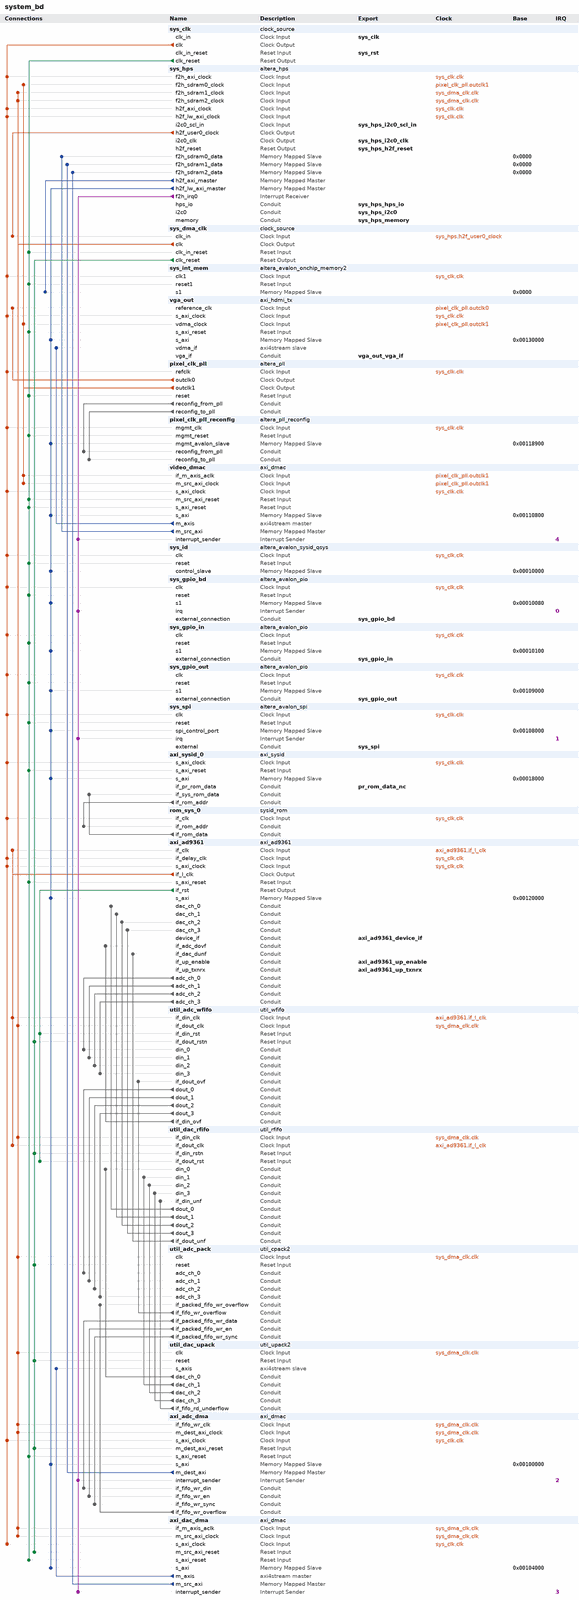
[diagram p0: system contents, whole]
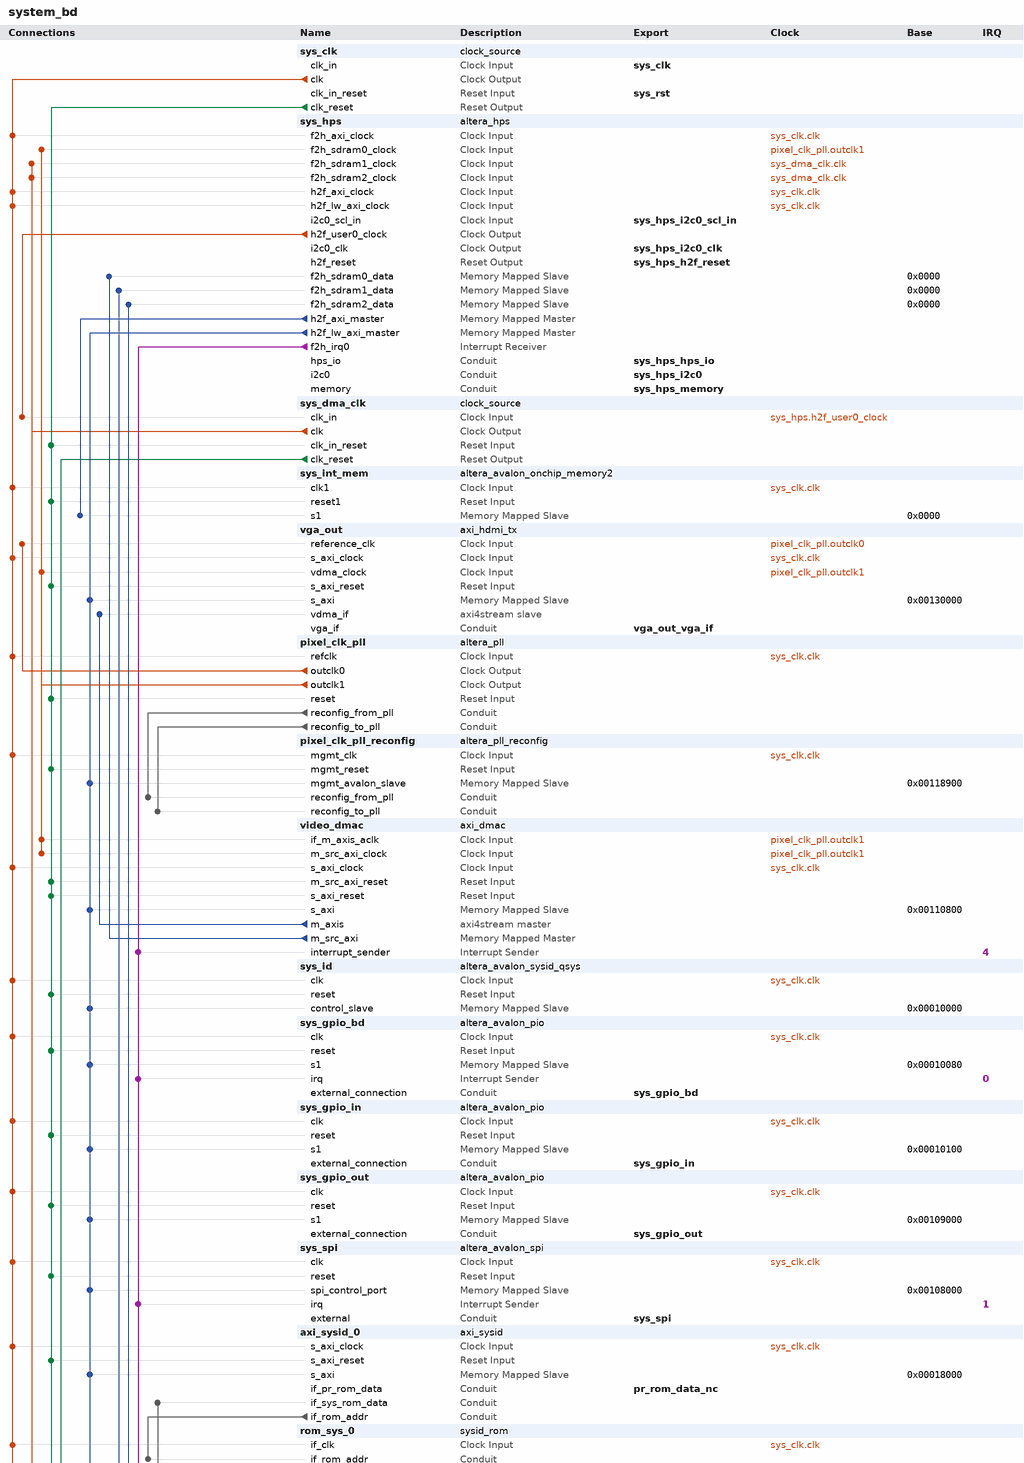
[diagram p1: system contents, upper part]
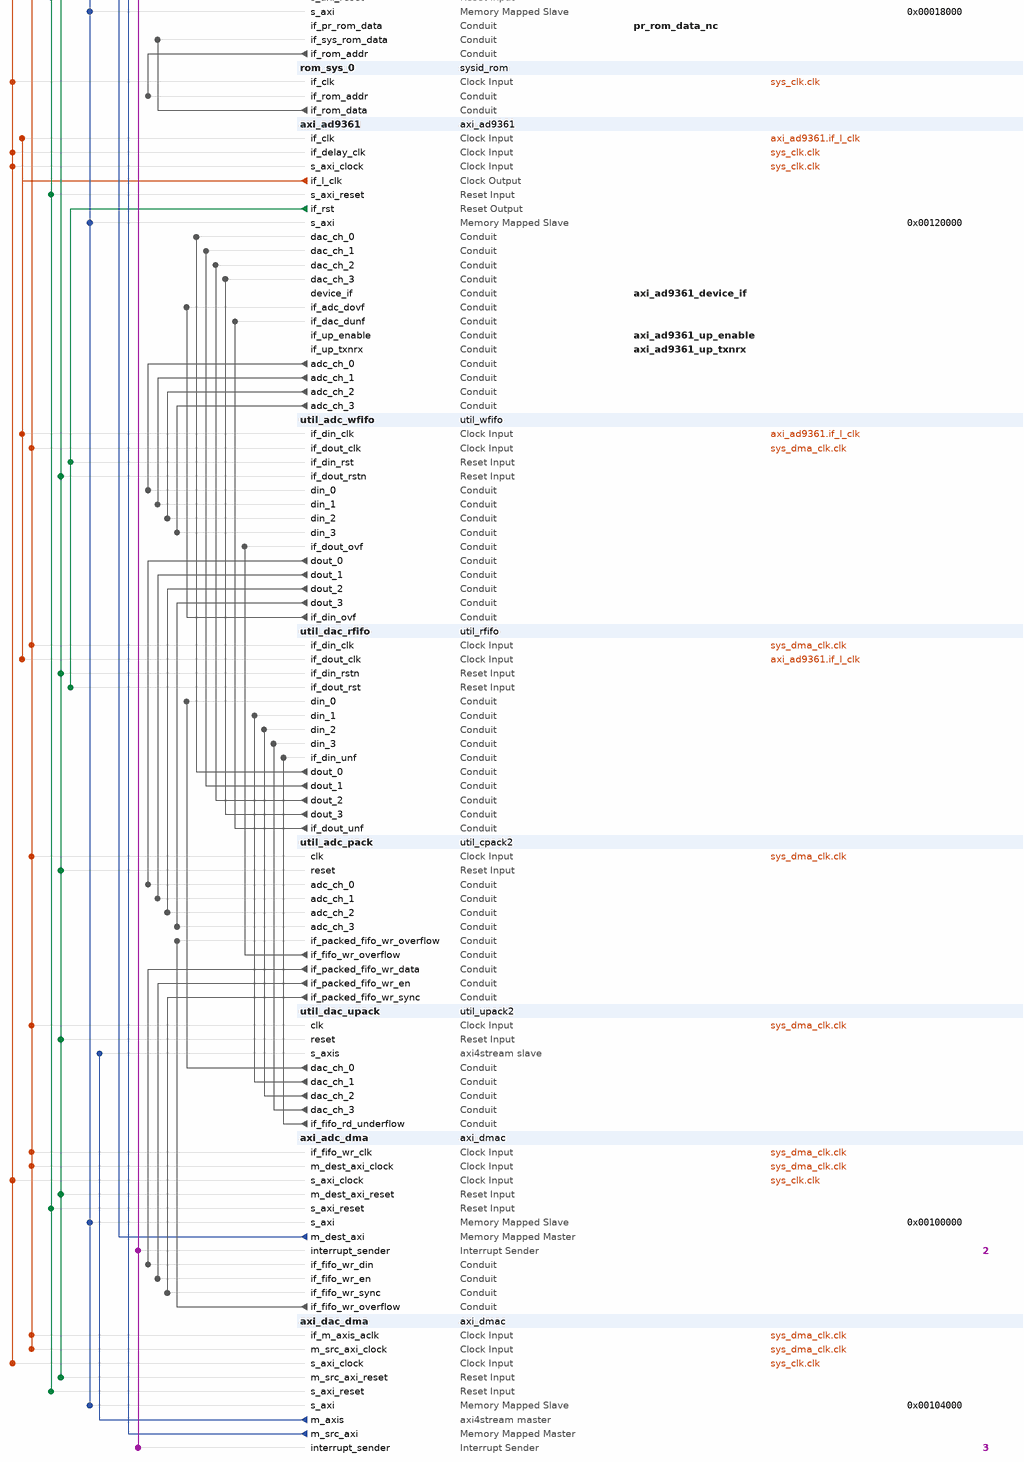
[diagram p2: system contents, lower part]
# Platform Designer (Qsys) system system_bd, Cyclone V 5CSXFC6D6F31C8ES
# Parameters at their usual value, and those the tool derives, are not listed.
package require -exact qsys 21.1
create_system system_bd
set_project_property DEVICE_FAMILY {Cyclone V}
set_project_property DEVICE 5CSXFC6D6F31C8ES

add_instance sys_clk clock_source 21.1
set_instance_parameter_value sys_clk clockFrequency 50000000

add_instance sys_hps altera_hps 21.1
set_instance_parameter_value sys_hps EMAC1_Mode RGMII
set_instance_parameter_value sys_hps EMAC1_PinMuxing {HPS I/O Set 0}
set_instance_parameter_value sys_hps F2SCLK_COLDRST_Enable false
set_instance_parameter_value sys_hps F2SCLK_DBGRST_Enable false
set_instance_parameter_value sys_hps F2SCLK_WARMRST_Enable false
set_instance_parameter_value sys_hps F2SDRAM_Type AXI-3,AXI-3,AXI-3
set_instance_parameter_value sys_hps F2SDRAM_Width 64,128,64
set_instance_parameter_value sys_hps F2SINTERRUPT_Enable true
set_instance_parameter_value sys_hps F2S_Width 2
set_instance_parameter_value sys_hps FPGA_PERIPHERAL_OUTPUT_CLOCK_FREQ_EMAC0_GTX_CLK 125
set_instance_parameter_value sys_hps FPGA_PERIPHERAL_OUTPUT_CLOCK_FREQ_EMAC0_MD_CLK 2.5
set_instance_parameter_value sys_hps FPGA_PERIPHERAL_OUTPUT_CLOCK_FREQ_EMAC1_GTX_CLK 125
set_instance_parameter_value sys_hps FPGA_PERIPHERAL_OUTPUT_CLOCK_FREQ_EMAC1_MD_CLK 2.5
set_instance_parameter_value sys_hps HPS_PROTOCOL DDR3
set_instance_parameter_value sys_hps I2C0_Mode Full
set_instance_parameter_value sys_hps I2C0_PinMuxing FPGA
set_instance_parameter_value sys_hps I2C1_Mode N/A
set_instance_parameter_value sys_hps I2C1_PinMuxing Unused
set_instance_parameter_value sys_hps LWH2F_Enable true
set_instance_parameter_value sys_hps MEM_BANKADDR_WIDTH 3
set_instance_parameter_value sys_hps MEM_CLK_FREQ 400.0
set_instance_parameter_value sys_hps MEM_COL_ADDR_WIDTH 10
set_instance_parameter_value sys_hps MEM_DQ_WIDTH 32
set_instance_parameter_value sys_hps MEM_DRV_STR RZQ/7
set_instance_parameter_value sys_hps MEM_ROW_ADDR_WIDTH 15
set_instance_parameter_value sys_hps MEM_RTT_NOM RZQ/4
set_instance_parameter_value sys_hps MEM_RTT_WR RZQ/4
set_instance_parameter_value sys_hps MEM_TCL 11
set_instance_parameter_value sys_hps MEM_TFAW_NS 30.0
set_instance_parameter_value sys_hps MEM_TRAS_NS 35.0
set_instance_parameter_value sys_hps MEM_TRCD_NS 13.75
set_instance_parameter_value sys_hps MEM_TRFC_NS 260.0
set_instance_parameter_value sys_hps MEM_TRP_NS 13.75
set_instance_parameter_value sys_hps MEM_VENDOR JEDEC
set_instance_parameter_value sys_hps MEM_WTCL 8
set_instance_parameter_value sys_hps QSPI_Mode {1 SS}
set_instance_parameter_value sys_hps QSPI_PinMuxing {HPS I/O Set 0}
set_instance_parameter_value sys_hps REF_CLK_FREQ 25.0
set_instance_parameter_value sys_hps S2FCLK_USER0CLK_Enable true
set_instance_parameter_value sys_hps S2FCLK_USER2CLK 5
set_instance_parameter_value sys_hps S2F_Width 2
set_instance_parameter_value sys_hps SDIO_Mode {4-bit Data}
set_instance_parameter_value sys_hps SDIO_PinMuxing {HPS I/O Set 0}
set_instance_parameter_value sys_hps SPIM1_Mode {Single Slave Select}
set_instance_parameter_value sys_hps SPIM1_PinMuxing {HPS I/O Set 0}
set_instance_parameter_value sys_hps STM_Enable false
set_instance_parameter_value sys_hps TIMING_BOARD_AC_SKEW 0.03
set_instance_parameter_value sys_hps TIMING_BOARD_AC_TO_CK_SKEW 0.0
set_instance_parameter_value sys_hps TIMING_BOARD_DQ_TO_DQS_SKEW 0.0
set_instance_parameter_value sys_hps TIMING_BOARD_MAX_CK_DELAY 0.03
set_instance_parameter_value sys_hps TIMING_BOARD_MAX_DQS_DELAY 0.02
set_instance_parameter_value sys_hps TIMING_BOARD_SKEW_BETWEEN_DQS 0.08
set_instance_parameter_value sys_hps TIMING_BOARD_SKEW_CKDQS_DIMM_MAX 0.16
set_instance_parameter_value sys_hps TIMING_BOARD_SKEW_CKDQS_DIMM_MIN 0.09
set_instance_parameter_value sys_hps TIMING_BOARD_SKEW_WITHIN_DQS 0.01
set_instance_parameter_value sys_hps TIMING_TDH 65
set_instance_parameter_value sys_hps TIMING_TDQSCK 255
set_instance_parameter_value sys_hps TIMING_TDQSQ 125
set_instance_parameter_value sys_hps TIMING_TDS 30
set_instance_parameter_value sys_hps TIMING_TIH 140
set_instance_parameter_value sys_hps TIMING_TIS 180
set_instance_parameter_value sys_hps TIMING_TQSH 0.4
set_instance_parameter_value sys_hps UART0_Mode {No Flow Control}
set_instance_parameter_value sys_hps UART0_PinMuxing {HPS I/O Set 0}
set_instance_parameter_value sys_hps USB1_Mode SDR
set_instance_parameter_value sys_hps USB1_PinMuxing {HPS I/O Set 0}
set_instance_parameter_value sys_hps desired_cfg_clk_mhz 80.0
set_instance_parameter_value sys_hps desired_qspi_clk_mhz 400.0

add_instance sys_dma_clk clock_source 21.1
set_instance_parameter_value sys_dma_clk clockFrequency 50000000

add_instance sys_int_mem altera_avalon_onchip_memory2 21.1
set_instance_parameter_value sys_int_mem dataWidth 64
set_instance_parameter_value sys_int_mem dualPort false
set_instance_parameter_value sys_int_mem initMemContent false
set_instance_parameter_value sys_int_mem initializationFileName onchip_mem.hex
set_instance_parameter_value sys_int_mem memorySize 65536

add_instance vga_out axi_hdmi_tx 1.0
set_instance_parameter_value vga_out CR_CB_N 0
set_instance_parameter_value vga_out DEVICE 5CSXFC6D6F31C8ES
set_instance_parameter_value vga_out FPGA_TECHNOLOGY_MANUAL 100
set_instance_parameter_value vga_out ID 0
set_instance_parameter_value vga_out INTERFACE VGA_INTERFACE

add_instance pixel_clk_pll altera_pll 21.1
set_instance_parameter_value pixel_clk_pll gui_device_speed_grade 2
set_instance_parameter_value pixel_clk_pll gui_en_reconf true
set_instance_parameter_value pixel_clk_pll gui_number_of_clocks 2
set_instance_parameter_value pixel_clk_pll gui_operation_mode direct
set_instance_parameter_value pixel_clk_pll gui_output_clock_frequency0 65.0
set_instance_parameter_value pixel_clk_pll gui_output_clock_frequency1 100.0
set_instance_parameter_value pixel_clk_pll gui_pll_mode {Integer-N PLL}
set_instance_parameter_value pixel_clk_pll gui_reference_clock_frequency 50.0
set_instance_parameter_value pixel_clk_pll gui_use_locked false

add_instance pixel_clk_pll_reconfig altera_pll_reconfig 21.1

add_instance video_dmac axi_dmac 1.0
set_instance_parameter_value video_dmac ASYNC_CLK_DEST_REQ_MANUAL 1
set_instance_parameter_value video_dmac ASYNC_CLK_REQ_SRC_MANUAL 1
set_instance_parameter_value video_dmac ASYNC_CLK_SRC_DEST_MANUAL 1
set_instance_parameter_value video_dmac AXI_SLICE_DEST 0
set_instance_parameter_value video_dmac AXI_SLICE_SRC 0
set_instance_parameter_value video_dmac CLK_DOMAIN_DEST_AXI 0
set_instance_parameter_value video_dmac CLK_DOMAIN_DEST_FIFO 0
set_instance_parameter_value video_dmac CLK_DOMAIN_DEST_SAXI 4
set_instance_parameter_value video_dmac CLK_DOMAIN_REQ 5
set_instance_parameter_value video_dmac CLK_DOMAIN_SRC_AXI 4
set_instance_parameter_value video_dmac CLK_DOMAIN_SRC_FIFO 0
set_instance_parameter_value video_dmac CLK_DOMAIN_SRC_SAXI 0
set_instance_parameter_value video_dmac CYCLIC 1
set_instance_parameter_value video_dmac DISABLE_DEBUG_REGISTERS 0
set_instance_parameter_value video_dmac DMA_2D_TRANSFER 1
set_instance_parameter_value video_dmac DMA_AXIS_DEST_W 4
set_instance_parameter_value video_dmac DMA_AXIS_ID_W 8
set_instance_parameter_value video_dmac DMA_AXI_PROTOCOL_DEST 1
set_instance_parameter_value video_dmac DMA_AXI_PROTOCOL_SRC 1
set_instance_parameter_value video_dmac DMA_DATA_WIDTH_DEST 64
set_instance_parameter_value video_dmac DMA_DATA_WIDTH_SRC 64
set_instance_parameter_value video_dmac DMA_LENGTH_WIDTH 24
set_instance_parameter_value video_dmac DMA_TYPE_DEST 1
set_instance_parameter_value video_dmac DMA_TYPE_SRC 0
set_instance_parameter_value video_dmac ENABLE_DIAGNOSTICS_IF 0
set_instance_parameter_value video_dmac FIFO_SIZE 8
set_instance_parameter_value video_dmac HAS_AXIS_TDEST 0
set_instance_parameter_value video_dmac HAS_AXIS_TID 0
set_instance_parameter_value video_dmac HAS_AXIS_TKEEP 0
set_instance_parameter_value video_dmac HAS_AXIS_TLAST 1
set_instance_parameter_value video_dmac HAS_AXIS_TSTRB 0
set_instance_parameter_value video_dmac HAS_AXIS_TUSER 0
set_instance_parameter_value video_dmac ID 0
set_instance_parameter_value video_dmac MAX_BYTES_PER_BURST 128
set_instance_parameter_value video_dmac SYNC_TRANSFER_START 0

add_instance sys_id altera_avalon_sysid_qsys 21.1
set_instance_parameter_value sys_id id -1395322110

add_instance sys_gpio_bd altera_avalon_pio 21.1
set_instance_parameter_value sys_gpio_bd direction InOut
set_instance_parameter_value sys_gpio_bd generateIRQ true
set_instance_parameter_value sys_gpio_bd width 32

add_instance sys_gpio_in altera_avalon_pio 21.1
set_instance_parameter_value sys_gpio_in direction Input
set_instance_parameter_value sys_gpio_in generateIRQ true
set_instance_parameter_value sys_gpio_in width 32

add_instance sys_gpio_out altera_avalon_pio 21.1
set_instance_parameter_value sys_gpio_out direction Output
set_instance_parameter_value sys_gpio_out width 32

add_instance sys_spi altera_avalon_spi 21.1
set_instance_parameter_value sys_spi clockPolarity 1
set_instance_parameter_value sys_spi dataWidth 8
set_instance_parameter_value sys_spi masterSPI true
set_instance_parameter_value sys_spi numberOfSlaves 1
set_instance_parameter_value sys_spi targetClockRate 50000000

add_instance axi_sysid_0 axi_sysid 1.0
set_instance_parameter_value axi_sysid_0 ROM_ADDR_BITS 9
set_instance_parameter_value axi_sysid_0 ROM_WIDTH 32

add_instance rom_sys_0 sysid_rom 1.0
set_instance_parameter_value rom_sys_0 PATH_TO_FILE /home/guest/hdl_repo/jemfg/jemfgeronimo_hdl/hdl/projects/arradio/c5soc/mem_init_sys.txt
set_instance_parameter_value rom_sys_0 ROM_ADDR_BITS 9
set_instance_parameter_value rom_sys_0 ROM_WIDTH 32

add_instance axi_ad9361 axi_ad9361 1.0
set_instance_parameter_value axi_ad9361 ADC_DATAFORMAT_DISABLE 0
set_instance_parameter_value axi_ad9361 ADC_DATAPATH_DISABLE 0
set_instance_parameter_value axi_ad9361 ADC_DCFILTER_DISABLE 0
set_instance_parameter_value axi_ad9361 ADC_IQCORRECTION_DISABLE 0
set_instance_parameter_value axi_ad9361 ADC_USERPORTS_DISABLE 0
set_instance_parameter_value axi_ad9361 CMOS_OR_LVDS_N 0
set_instance_parameter_value axi_ad9361 DAC_DATAPATH_DISABLE 0
set_instance_parameter_value axi_ad9361 DAC_DDS_DISABLE 0
set_instance_parameter_value axi_ad9361 DAC_IODELAY_ENABLE 0
set_instance_parameter_value axi_ad9361 DAC_IQCORRECTION_DISABLE 0
set_instance_parameter_value axi_ad9361 DAC_USERPORTS_DISABLE 0
set_instance_parameter_value axi_ad9361 DEVICE 5CSXFC6D6F31C8ES
set_instance_parameter_value axi_ad9361 DEV_PACKAGE_MANUAL 0
set_instance_parameter_value axi_ad9361 FPGA_FAMILY_MANUAL 0
set_instance_parameter_value axi_ad9361 FPGA_TECHNOLOGY_MANUAL 100
set_instance_parameter_value axi_ad9361 ID 0
set_instance_parameter_value axi_ad9361 IO_DELAY_GROUP dev_if_delay_group
set_instance_parameter_value axi_ad9361 MIMO_ENABLE 0
set_instance_parameter_value axi_ad9361 MODE_1R1T 0
set_instance_parameter_value axi_ad9361 RX_NODPA 0
set_instance_parameter_value axi_ad9361 SPEED_GRADE_MANUAL 0
set_instance_parameter_value axi_ad9361 TDD_DISABLE 0

add_instance util_adc_wfifo util_wfifo 1.0
set_instance_parameter_value util_adc_wfifo DIN_ADDRESS_WIDTH 5
set_instance_parameter_value util_adc_wfifo DIN_DATA_WIDTH 16
set_instance_parameter_value util_adc_wfifo DOUT_DATA_WIDTH 16
set_instance_parameter_value util_adc_wfifo NUM_OF_CHANNELS 4

add_instance util_dac_rfifo util_rfifo 1.0
set_instance_parameter_value util_dac_rfifo DIN_ADDRESS_WIDTH 5
set_instance_parameter_value util_dac_rfifo DIN_DATA_WIDTH 16
set_instance_parameter_value util_dac_rfifo DOUT_DATA_WIDTH 16
set_instance_parameter_value util_dac_rfifo NUM_OF_CHANNELS 4

add_instance util_adc_pack util_cpack2 1.0
set_instance_parameter_value util_adc_pack NUM_OF_CHANNELS 4
set_instance_parameter_value util_adc_pack SAMPLES_PER_CHANNEL 1
set_instance_parameter_value util_adc_pack SAMPLE_DATA_WIDTH 16

add_instance util_dac_upack util_upack2 1.0
set_instance_parameter_value util_dac_upack INTERFACE_TYPE 0
set_instance_parameter_value util_dac_upack NUM_OF_CHANNELS 4
set_instance_parameter_value util_dac_upack SAMPLES_PER_CHANNEL 1
set_instance_parameter_value util_dac_upack SAMPLE_DATA_WIDTH 16

add_instance axi_adc_dma axi_dmac 1.0
set_instance_parameter_value axi_adc_dma ASYNC_CLK_DEST_REQ_MANUAL 1
set_instance_parameter_value axi_adc_dma ASYNC_CLK_REQ_SRC_MANUAL 1
set_instance_parameter_value axi_adc_dma ASYNC_CLK_SRC_DEST_MANUAL 1
set_instance_parameter_value axi_adc_dma AXI_SLICE_DEST 0
set_instance_parameter_value axi_adc_dma AXI_SLICE_SRC 0
set_instance_parameter_value axi_adc_dma CLK_DOMAIN_DEST_AXI 7
set_instance_parameter_value axi_adc_dma CLK_DOMAIN_DEST_FIFO 0
set_instance_parameter_value axi_adc_dma CLK_DOMAIN_DEST_SAXI 0
set_instance_parameter_value axi_adc_dma CLK_DOMAIN_REQ 5
set_instance_parameter_value axi_adc_dma CLK_DOMAIN_SRC_AXI 0
set_instance_parameter_value axi_adc_dma CLK_DOMAIN_SRC_FIFO 7
set_instance_parameter_value axi_adc_dma CLK_DOMAIN_SRC_SAXI 0
set_instance_parameter_value axi_adc_dma CYCLIC 0
set_instance_parameter_value axi_adc_dma DISABLE_DEBUG_REGISTERS 0
set_instance_parameter_value axi_adc_dma DMA_2D_TRANSFER 0
set_instance_parameter_value axi_adc_dma DMA_AXIS_DEST_W 4
set_instance_parameter_value axi_adc_dma DMA_AXIS_ID_W 8
set_instance_parameter_value axi_adc_dma DMA_AXI_PROTOCOL_DEST 1
set_instance_parameter_value axi_adc_dma DMA_AXI_PROTOCOL_SRC 1
set_instance_parameter_value axi_adc_dma DMA_DATA_WIDTH_DEST 128
set_instance_parameter_value axi_adc_dma DMA_DATA_WIDTH_SRC 64
set_instance_parameter_value axi_adc_dma DMA_LENGTH_WIDTH 24
set_instance_parameter_value axi_adc_dma DMA_TYPE_DEST 0
set_instance_parameter_value axi_adc_dma DMA_TYPE_SRC 2
set_instance_parameter_value axi_adc_dma ENABLE_DIAGNOSTICS_IF 0
set_instance_parameter_value axi_adc_dma FIFO_SIZE 4
set_instance_parameter_value axi_adc_dma HAS_AXIS_TDEST 0
set_instance_parameter_value axi_adc_dma HAS_AXIS_TID 0
set_instance_parameter_value axi_adc_dma HAS_AXIS_TKEEP 0
set_instance_parameter_value axi_adc_dma HAS_AXIS_TLAST 0
set_instance_parameter_value axi_adc_dma HAS_AXIS_TSTRB 0
set_instance_parameter_value axi_adc_dma HAS_AXIS_TUSER 0
set_instance_parameter_value axi_adc_dma ID 0
set_instance_parameter_value axi_adc_dma MAX_BYTES_PER_BURST 128
set_instance_parameter_value axi_adc_dma SYNC_TRANSFER_START 1

add_instance axi_dac_dma axi_dmac 1.0
set_instance_parameter_value axi_dac_dma ASYNC_CLK_DEST_REQ_MANUAL 1
set_instance_parameter_value axi_dac_dma ASYNC_CLK_REQ_SRC_MANUAL 1
set_instance_parameter_value axi_dac_dma ASYNC_CLK_SRC_DEST_MANUAL 1
set_instance_parameter_value axi_dac_dma AXI_SLICE_DEST 0
set_instance_parameter_value axi_dac_dma AXI_SLICE_SRC 0
set_instance_parameter_value axi_dac_dma CLK_DOMAIN_DEST_AXI 0
set_instance_parameter_value axi_dac_dma CLK_DOMAIN_DEST_FIFO 0
set_instance_parameter_value axi_dac_dma CLK_DOMAIN_DEST_SAXI 7
set_instance_parameter_value axi_dac_dma CLK_DOMAIN_REQ 5
set_instance_parameter_value axi_dac_dma CLK_DOMAIN_SRC_AXI 7
set_instance_parameter_value axi_dac_dma CLK_DOMAIN_SRC_FIFO 0
set_instance_parameter_value axi_dac_dma CLK_DOMAIN_SRC_SAXI 0
set_instance_parameter_value axi_dac_dma CYCLIC 1
set_instance_parameter_value axi_dac_dma DISABLE_DEBUG_REGISTERS 0
set_instance_parameter_value axi_dac_dma DMA_2D_TRANSFER 0
set_instance_parameter_value axi_dac_dma DMA_AXIS_DEST_W 4
set_instance_parameter_value axi_dac_dma DMA_AXIS_ID_W 8
set_instance_parameter_value axi_dac_dma DMA_AXI_PROTOCOL_DEST 1
set_instance_parameter_value axi_dac_dma DMA_AXI_PROTOCOL_SRC 1
set_instance_parameter_value axi_dac_dma DMA_DATA_WIDTH_DEST 64
set_instance_parameter_value axi_dac_dma DMA_DATA_WIDTH_SRC 64
set_instance_parameter_value axi_dac_dma DMA_LENGTH_WIDTH 24
set_instance_parameter_value axi_dac_dma DMA_TYPE_DEST 1
set_instance_parameter_value axi_dac_dma DMA_TYPE_SRC 0
set_instance_parameter_value axi_dac_dma ENABLE_DIAGNOSTICS_IF 0
set_instance_parameter_value axi_dac_dma FIFO_SIZE 4
set_instance_parameter_value axi_dac_dma HAS_AXIS_TDEST 0
set_instance_parameter_value axi_dac_dma HAS_AXIS_TID 0
set_instance_parameter_value axi_dac_dma HAS_AXIS_TKEEP 0
set_instance_parameter_value axi_dac_dma HAS_AXIS_TLAST 0
set_instance_parameter_value axi_dac_dma HAS_AXIS_TSTRB 0
set_instance_parameter_value axi_dac_dma HAS_AXIS_TUSER 0
set_instance_parameter_value axi_dac_dma ID 0
set_instance_parameter_value axi_dac_dma MAX_BYTES_PER_BURST 128
set_instance_parameter_value axi_dac_dma SYNC_TRANSFER_START 0

# connections
add_connection axi_ad9361.if_l_clk axi_ad9361.if_clk clock
add_connection axi_ad9361.if_l_clk util_adc_wfifo.if_din_clk clock
add_connection axi_ad9361.if_l_clk util_dac_rfifo.if_dout_clk clock
add_connection pixel_clk_pll.outclk0 vga_out.reference_clk clock
add_connection pixel_clk_pll.outclk1 sys_hps.f2h_sdram0_clock clock
add_connection pixel_clk_pll.outclk1 vga_out.vdma_clock clock
add_connection pixel_clk_pll.outclk1 video_dmac.if_m_axis_aclk clock
add_connection pixel_clk_pll.outclk1 video_dmac.m_src_axi_clock clock
add_connection sys_clk.clk axi_ad9361.if_delay_clk clock
add_connection sys_clk.clk axi_ad9361.s_axi_clock clock
add_connection sys_clk.clk axi_adc_dma.s_axi_clock clock
add_connection sys_clk.clk axi_dac_dma.s_axi_clock clock
add_connection sys_clk.clk axi_sysid_0.s_axi_clock clock
add_connection sys_clk.clk pixel_clk_pll.refclk clock
add_connection sys_clk.clk pixel_clk_pll_reconfig.mgmt_clk clock
add_connection sys_clk.clk rom_sys_0.if_clk clock
add_connection sys_clk.clk sys_gpio_bd.clk clock
add_connection sys_clk.clk sys_gpio_in.clk clock
add_connection sys_clk.clk sys_gpio_out.clk clock
add_connection sys_clk.clk sys_hps.f2h_axi_clock clock
add_connection sys_clk.clk sys_hps.h2f_axi_clock clock
add_connection sys_clk.clk sys_hps.h2f_lw_axi_clock clock
add_connection sys_clk.clk sys_id.clk clock
add_connection sys_clk.clk sys_int_mem.clk1 clock
add_connection sys_clk.clk sys_spi.clk clock
add_connection sys_clk.clk vga_out.s_axi_clock clock
add_connection sys_clk.clk video_dmac.s_axi_clock clock
add_connection sys_dma_clk.clk axi_adc_dma.if_fifo_wr_clk clock
add_connection sys_dma_clk.clk axi_adc_dma.m_dest_axi_clock clock
add_connection sys_dma_clk.clk axi_dac_dma.if_m_axis_aclk clock
add_connection sys_dma_clk.clk axi_dac_dma.m_src_axi_clock clock
add_connection sys_dma_clk.clk sys_hps.f2h_sdram1_clock clock
add_connection sys_dma_clk.clk sys_hps.f2h_sdram2_clock clock
add_connection sys_dma_clk.clk util_adc_pack.clk clock
add_connection sys_dma_clk.clk util_adc_wfifo.if_dout_clk clock
add_connection sys_dma_clk.clk util_dac_rfifo.if_din_clk clock
add_connection sys_dma_clk.clk util_dac_upack.clk clock
add_connection sys_hps.h2f_user0_clock sys_dma_clk.clk_in clock
add_connection axi_ad9361.if_rst util_adc_wfifo.if_din_rst reset
add_connection axi_ad9361.if_rst util_dac_rfifo.if_dout_rst reset
add_connection sys_clk.clk_reset axi_ad9361.s_axi_reset reset
add_connection sys_clk.clk_reset axi_adc_dma.s_axi_reset reset
add_connection sys_clk.clk_reset axi_dac_dma.s_axi_reset reset
add_connection sys_clk.clk_reset axi_sysid_0.s_axi_reset reset
add_connection sys_clk.clk_reset pixel_clk_pll.reset reset
add_connection sys_clk.clk_reset pixel_clk_pll_reconfig.mgmt_reset reset
add_connection sys_clk.clk_reset sys_dma_clk.clk_in_reset reset
add_connection sys_clk.clk_reset sys_gpio_bd.reset reset
add_connection sys_clk.clk_reset sys_gpio_in.reset reset
add_connection sys_clk.clk_reset sys_gpio_out.reset reset
add_connection sys_clk.clk_reset sys_id.reset reset
add_connection sys_clk.clk_reset sys_int_mem.reset1 reset
add_connection sys_clk.clk_reset sys_spi.reset reset
add_connection sys_clk.clk_reset vga_out.s_axi_reset reset
add_connection sys_clk.clk_reset video_dmac.m_src_axi_reset reset
add_connection sys_clk.clk_reset video_dmac.s_axi_reset reset
add_connection sys_dma_clk.clk_reset axi_adc_dma.m_dest_axi_reset reset
add_connection sys_dma_clk.clk_reset axi_dac_dma.m_src_axi_reset reset
add_connection sys_dma_clk.clk_reset util_adc_pack.reset reset
add_connection sys_dma_clk.clk_reset util_adc_wfifo.if_dout_rstn reset
add_connection sys_dma_clk.clk_reset util_dac_rfifo.if_din_rstn reset
add_connection sys_dma_clk.clk_reset util_dac_upack.reset reset
add_connection axi_adc_dma.m_dest_axi sys_hps.f2h_sdram1_data avalon
set_connection_parameter_value axi_adc_dma.m_dest_axi/sys_hps.f2h_sdram1_data baseAddress 0x0000
add_connection axi_dac_dma.m_src_axi sys_hps.f2h_sdram2_data avalon
set_connection_parameter_value axi_dac_dma.m_src_axi/sys_hps.f2h_sdram2_data baseAddress 0x0000
add_connection sys_hps.h2f_axi_master sys_int_mem.s1 avalon
set_connection_parameter_value sys_hps.h2f_axi_master/sys_int_mem.s1 baseAddress 0x0000
add_connection sys_hps.h2f_lw_axi_master axi_ad9361.s_axi avalon
set_connection_parameter_value sys_hps.h2f_lw_axi_master/axi_ad9361.s_axi baseAddress 0x00120000
add_connection sys_hps.h2f_lw_axi_master axi_adc_dma.s_axi avalon
set_connection_parameter_value sys_hps.h2f_lw_axi_master/axi_adc_dma.s_axi baseAddress 0x00100000
add_connection sys_hps.h2f_lw_axi_master axi_dac_dma.s_axi avalon
set_connection_parameter_value sys_hps.h2f_lw_axi_master/axi_dac_dma.s_axi baseAddress 0x00104000
add_connection sys_hps.h2f_lw_axi_master axi_sysid_0.s_axi avalon
set_connection_parameter_value sys_hps.h2f_lw_axi_master/axi_sysid_0.s_axi baseAddress 0x00018000
add_connection sys_hps.h2f_lw_axi_master pixel_clk_pll_reconfig.mgmt_avalon_slave avalon
set_connection_parameter_value sys_hps.h2f_lw_axi_master/pixel_clk_pll_reconfig.mgmt_avalon_slave baseAddress 0x00118900
add_connection sys_hps.h2f_lw_axi_master sys_gpio_bd.s1 avalon
set_connection_parameter_value sys_hps.h2f_lw_axi_master/sys_gpio_bd.s1 baseAddress 0x00010080
add_connection sys_hps.h2f_lw_axi_master sys_gpio_in.s1 avalon
set_connection_parameter_value sys_hps.h2f_lw_axi_master/sys_gpio_in.s1 baseAddress 0x00010100
add_connection sys_hps.h2f_lw_axi_master sys_gpio_out.s1 avalon
set_connection_parameter_value sys_hps.h2f_lw_axi_master/sys_gpio_out.s1 baseAddress 0x00109000
add_connection sys_hps.h2f_lw_axi_master sys_id.control_slave avalon
set_connection_parameter_value sys_hps.h2f_lw_axi_master/sys_id.control_slave baseAddress 0x00010000
add_connection sys_hps.h2f_lw_axi_master sys_spi.spi_control_port avalon
set_connection_parameter_value sys_hps.h2f_lw_axi_master/sys_spi.spi_control_port baseAddress 0x00108000
add_connection sys_hps.h2f_lw_axi_master vga_out.s_axi avalon
set_connection_parameter_value sys_hps.h2f_lw_axi_master/vga_out.s_axi baseAddress 0x00130000
add_connection sys_hps.h2f_lw_axi_master video_dmac.s_axi avalon
set_connection_parameter_value sys_hps.h2f_lw_axi_master/video_dmac.s_axi baseAddress 0x00110800
add_connection video_dmac.m_src_axi sys_hps.f2h_sdram0_data avalon
set_connection_parameter_value video_dmac.m_src_axi/sys_hps.f2h_sdram0_data baseAddress 0x0000
add_connection axi_dac_dma.m_axis util_dac_upack.s_axis axi4stream
add_connection video_dmac.m_axis vga_out.vdma_if axi4stream
add_connection axi_ad9361.adc_ch_0 util_adc_wfifo.din_0 conduit
add_connection axi_ad9361.adc_ch_1 util_adc_wfifo.din_1 conduit
add_connection axi_ad9361.adc_ch_2 util_adc_wfifo.din_2 conduit
add_connection axi_ad9361.adc_ch_3 util_adc_wfifo.din_3 conduit
add_connection axi_adc_dma.if_fifo_wr_overflow util_adc_pack.if_packed_fifo_wr_overflow conduit
add_connection axi_sysid_0.if_rom_addr rom_sys_0.if_rom_addr conduit
add_connection pixel_clk_pll.reconfig_from_pll pixel_clk_pll_reconfig.reconfig_from_pll conduit
add_connection pixel_clk_pll.reconfig_to_pll pixel_clk_pll_reconfig.reconfig_to_pll conduit
add_connection rom_sys_0.if_rom_data axi_sysid_0.if_sys_rom_data conduit
add_connection util_adc_pack.if_fifo_wr_overflow util_adc_wfifo.if_dout_ovf conduit
add_connection util_adc_pack.if_packed_fifo_wr_data axi_adc_dma.if_fifo_wr_din conduit
add_connection util_adc_pack.if_packed_fifo_wr_en axi_adc_dma.if_fifo_wr_en conduit
add_connection util_adc_pack.if_packed_fifo_wr_sync axi_adc_dma.if_fifo_wr_sync conduit
add_connection util_adc_wfifo.dout_0 util_adc_pack.adc_ch_0 conduit
add_connection util_adc_wfifo.dout_1 util_adc_pack.adc_ch_1 conduit
add_connection util_adc_wfifo.dout_2 util_adc_pack.adc_ch_2 conduit
add_connection util_adc_wfifo.dout_3 util_adc_pack.adc_ch_3 conduit
add_connection util_adc_wfifo.if_din_ovf axi_ad9361.if_adc_dovf conduit
add_connection util_dac_rfifo.dout_0 axi_ad9361.dac_ch_0 conduit
add_connection util_dac_rfifo.dout_1 axi_ad9361.dac_ch_1 conduit
add_connection util_dac_rfifo.dout_2 axi_ad9361.dac_ch_2 conduit
add_connection util_dac_rfifo.dout_3 axi_ad9361.dac_ch_3 conduit
add_connection util_dac_rfifo.if_dout_unf axi_ad9361.if_dac_dunf conduit
add_connection util_dac_upack.dac_ch_0 util_dac_rfifo.din_0 conduit
add_connection util_dac_upack.dac_ch_1 util_dac_rfifo.din_1 conduit
add_connection util_dac_upack.dac_ch_2 util_dac_rfifo.din_2 conduit
add_connection util_dac_upack.dac_ch_3 util_dac_rfifo.din_3 conduit
add_connection util_dac_upack.if_fifo_rd_underflow util_dac_rfifo.if_din_unf conduit
add_connection sys_hps.f2h_irq0 axi_adc_dma.interrupt_sender interrupt
set_connection_parameter_value sys_hps.f2h_irq0/axi_adc_dma.interrupt_sender irqNumber 2
add_connection sys_hps.f2h_irq0 axi_dac_dma.interrupt_sender interrupt
set_connection_parameter_value sys_hps.f2h_irq0/axi_dac_dma.interrupt_sender irqNumber 3
add_connection sys_hps.f2h_irq0 sys_gpio_bd.irq interrupt
set_connection_parameter_value sys_hps.f2h_irq0/sys_gpio_bd.irq irqNumber 0
add_connection sys_hps.f2h_irq0 sys_spi.irq interrupt
set_connection_parameter_value sys_hps.f2h_irq0/sys_spi.irq irqNumber 1
add_connection sys_hps.f2h_irq0 video_dmac.interrupt_sender interrupt
set_connection_parameter_value sys_hps.f2h_irq0/video_dmac.interrupt_sender irqNumber 4

# exported interfaces
add_interface axi_ad9361_device_if conduit end
set_interface_property axi_ad9361_device_if EXPORT_OF axi_ad9361.device_if
add_interface axi_ad9361_up_enable conduit end
set_interface_property axi_ad9361_up_enable EXPORT_OF axi_ad9361.if_up_enable
add_interface axi_ad9361_up_txnrx conduit end
set_interface_property axi_ad9361_up_txnrx EXPORT_OF axi_ad9361.if_up_txnrx
add_interface pr_rom_data_nc conduit end
set_interface_property pr_rom_data_nc EXPORT_OF axi_sysid_0.if_pr_rom_data
add_interface sys_clk clock sink
set_interface_property sys_clk EXPORT_OF sys_clk.clk_in
add_interface sys_gpio_bd conduit end
set_interface_property sys_gpio_bd EXPORT_OF sys_gpio_bd.external_connection
add_interface sys_gpio_in conduit end
set_interface_property sys_gpio_in EXPORT_OF sys_gpio_in.external_connection
add_interface sys_gpio_out conduit end
set_interface_property sys_gpio_out EXPORT_OF sys_gpio_out.external_connection
add_interface sys_hps_h2f_reset reset source
set_interface_property sys_hps_h2f_reset EXPORT_OF sys_hps.h2f_reset
add_interface sys_hps_hps_io conduit end
set_interface_property sys_hps_hps_io EXPORT_OF sys_hps.hps_io
add_interface sys_hps_i2c0 conduit end
set_interface_property sys_hps_i2c0 EXPORT_OF sys_hps.i2c0
add_interface sys_hps_i2c0_clk clock source
set_interface_property sys_hps_i2c0_clk EXPORT_OF sys_hps.i2c0_clk
add_interface sys_hps_i2c0_scl_in clock sink
set_interface_property sys_hps_i2c0_scl_in EXPORT_OF sys_hps.i2c0_scl_in
add_interface sys_hps_memory conduit end
set_interface_property sys_hps_memory EXPORT_OF sys_hps.memory
add_interface sys_rst reset sink
set_interface_property sys_rst EXPORT_OF sys_clk.clk_in_reset
add_interface sys_spi conduit end
set_interface_property sys_spi EXPORT_OF sys_spi.external
add_interface vga_out_vga_if conduit end
set_interface_property vga_out_vga_if EXPORT_OF vga_out.vga_if

set_interconnect_requirement {$system} qsys_mm.burstAdapterImplementation PER_BURST_TYPE_CONVERTER
set_interconnect_requirement {$system} qsys_mm.clockCrossingAdapter AUTO
set_interconnect_requirement {$system} qsys_mm.maxAdditionalLatency 4

save_system system_bd.qsys
